# EAGLE design line-following-car (EAGLE 7.4.0)
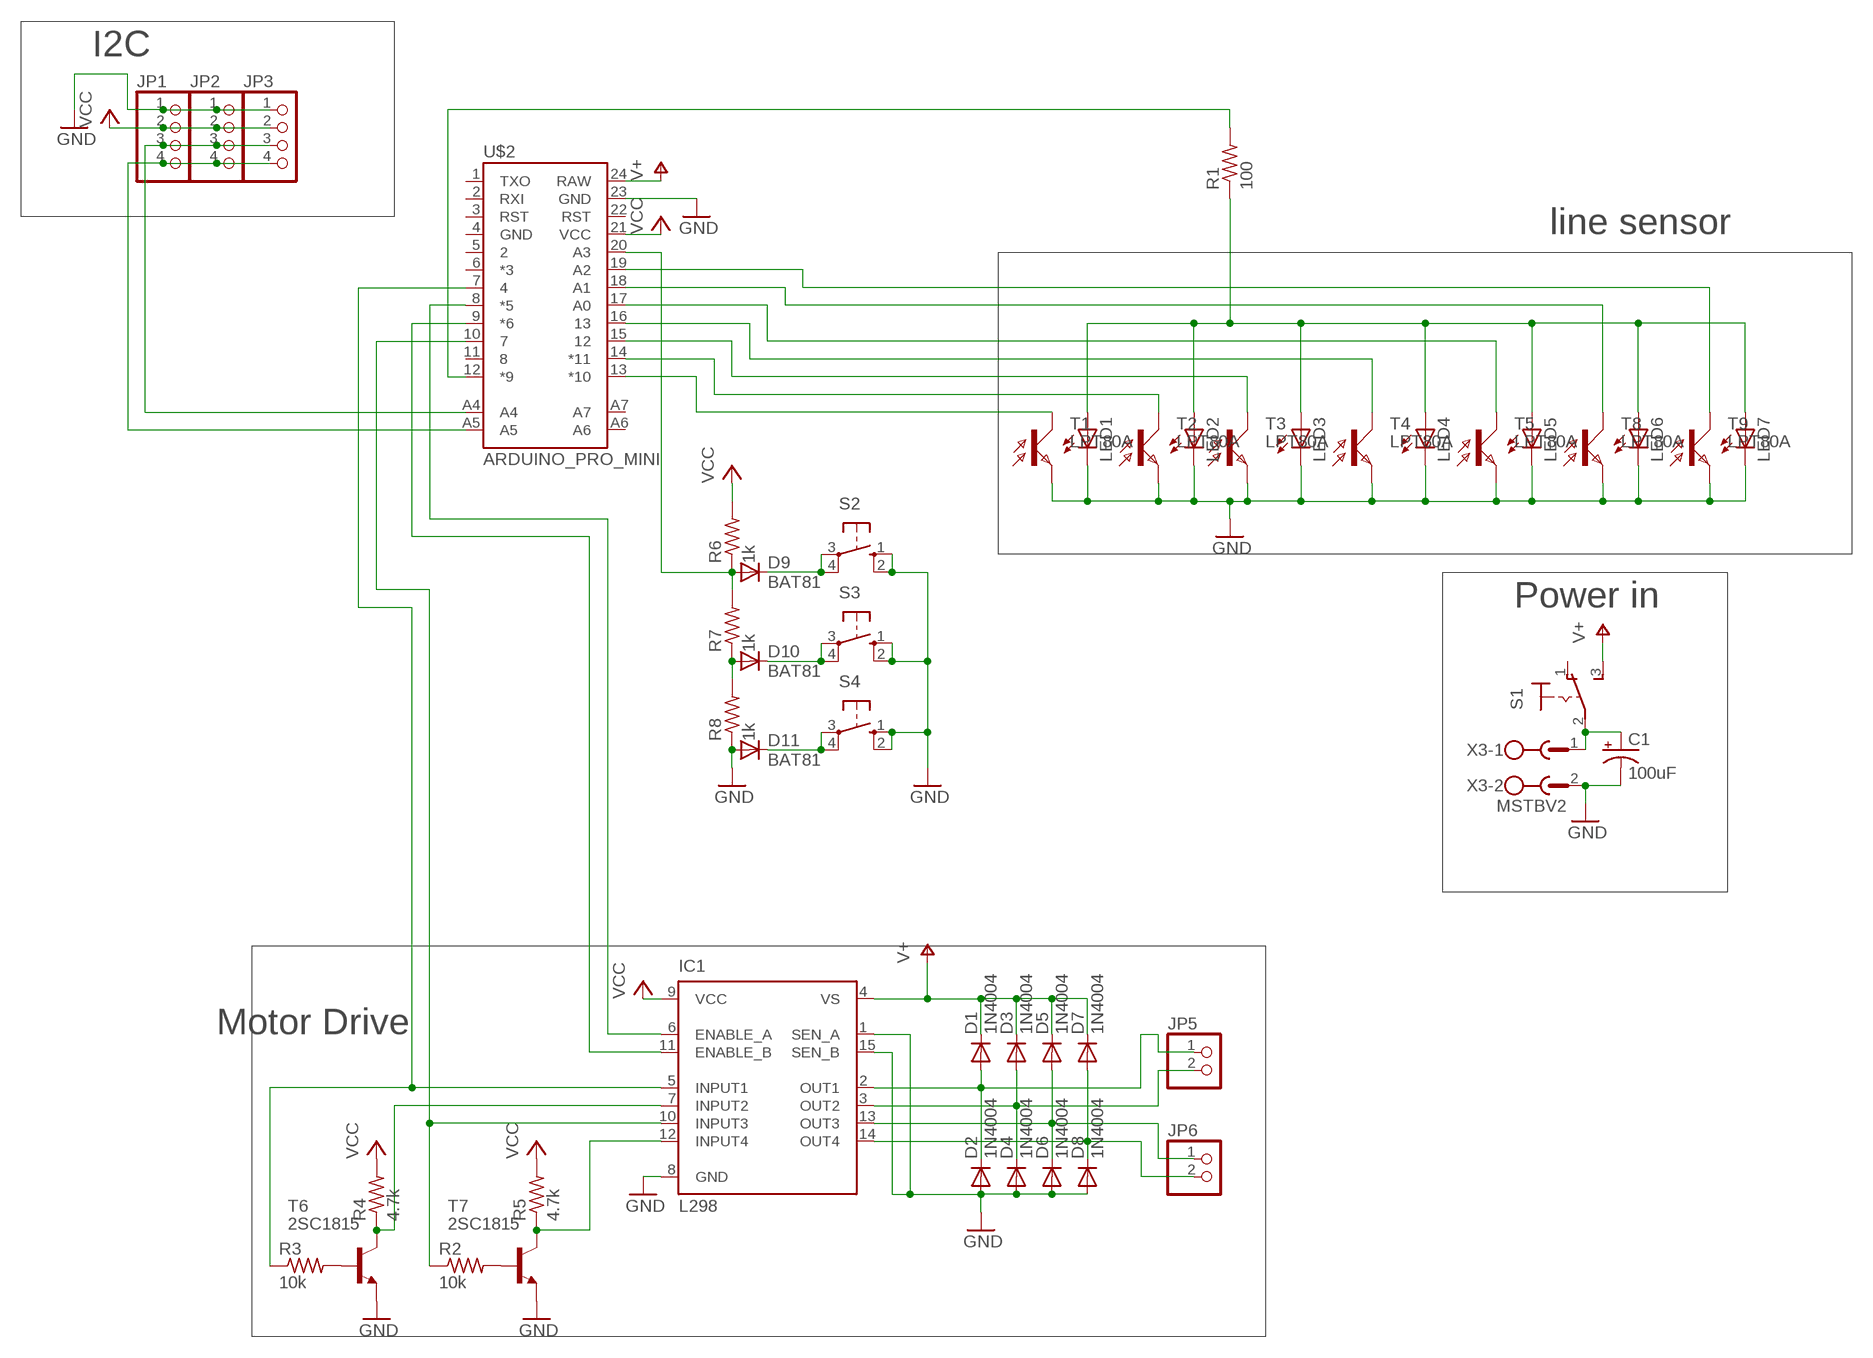
[diagram p0: schematic, sheet 1]

## Parts
C1  100uF  CPOL-USE2-4  [E2-4]
D1  1N4004  [DO41-10]
D2  1N4004  [DO41-10]
D3  1N4004  [DO41-10]
D4  1N4004  [DO41-10]
D5  1N4004  [DO41-10]
D6  1N4004  [DO41-10]
D7  1N4004  [DO41-10]
D8  1N4004  [DO41-10]
D9  BAT81  [DO34-7]
D10  BAT81  [DO34-7]
D11  BAT81  [DO34-7]
IC1  L298  [MULTIWATT-15]
JP1  PINHD-1X4  [1X04]
JP2  PINHD-1X4  [1X04]
JP3  PINHD-1X4  [1X04]
JP5  PINHD-1X2  [1X02]
JP6  PINHD-1X2  [1X02]
LED1  LED3MM  [LED3MM]
LED2  LED3MM  [LED3MM]
LED3  LED3MM  [LED3MM]
LED4  LED3MM  [LED3MM]
LED5  LED3MM  [LED3MM]
LED6  LED3MM  [LED3MM]
LED7  LED3MM  [LED3MM]
R1  100  R-US_0204/5  [0204/5]
R2  10k  R-US_0204/5  [0204/5]
R3  10k  R-US_0204/5  [0204/5]
R4  4.7k  R-US_0204/5  [0204/5]
R5  4.7k  R-US_0204/5  [0204/5]
R6  1k  R-US_0207/7  [0207/7]
R7  1k  R-US_0207/7  [0207/7]
R8  1k  R-US_0207/7  [0207/7]
S1  320-916  [320-916]
S2  10-XX  [B3F-10XX]
S3  10-XX  [B3F-10XX]
S4  10-XX  [B3F-10XX]
T1  LPT80A  [LPT80A]
T2  LPT80A  [LPT80A]
T3  LPT80A  [LPT80A]
T4  LPT80A  [LPT80A]
T5  LPT80A  [LPT80A]
T6  2SC1815  [TO92-ECB]
T7  2SC1815  [TO92-ECB]
T8  LPT80A  [LPT80A]
T9  LPT80A  [LPT80A]
U$2  ARDUINO_PRO_MINI  [ARDUINO_PRO_MINI]
X3  MSTBV2  [MSTBV2]

## Nets
GND: C1.- D2.A D4.A D6.A D8.A D11.A IC1.1(SEN_A) IC1.8(GND) IC1.15(SEN_B) JP1.1 JP2.1 JP3.1 LED1.K(C) LED2.K(C) LED3.K(C) LED4.K(C) LED5.K(C) LED6.K(C) LED7.K(C) R8.1 S2.1(S) S2.2(S1) S3.1(S) S3.2(S1) S4.1(S) S4.2(S1) T1.E T2.E T3.E T4.E T5.E T6.E T7.E T8.E T9.E U$2.23(GND) X3.2
N$1: LED1.A LED2.A LED3.A LED4.A LED5.A LED6.A LED7.A R1.1
N$2: R2.2 T7.B
N$3: R1.2 U$2.12(*9)
N$4: R3.2 T6.B
N$5: T1.C U$2.13(*10)
N$6: T2.C U$2.14(*11)
N$7: T3.C U$2.15
N$8: T4.C U$2.16
N$9: T5.C U$2.17(A0)
N$10: D1.A D2.C IC1.2(OUT1) JP5.1
N$11: IC1.7(INPUT2) R4.1 T6.C
N$12: IC1.12(INPUT4) R5.1 T7.C
N$13: D3.A D4.C IC1.3(OUT2) JP5.2
N$14: IC1.5(INPUT1) R3.1 U$2.7
N$15: IC1.6(ENABLE_A) U$2.8(*5)
N$16: IC1.10(INPUT3) R2.1 U$2.10
N$17: D9.A R6.1 R7.2 U$2.20(A3)
N$18: D5.A D6.C IC1.13(OUT3) JP6.1
N$19: D7.A D8.C IC1.14(OUT4) JP6.2
N$20: D10.A R7.1 R8.2
N$21: D9.C S2.3(P) S2.4(P1)
N$23: JP1.4 JP2.4 JP3.4 U$2.A5
N$24: IC1.11(ENABLE_B) U$2.9(*6)
N$25: D10.C S3.3(P) S3.4(P1)
N$26: C1.+ S1.2(P) X3.1
N$28: D11.C S4.3(P) S4.4(P1)
N$30: JP1.3 JP2.3 JP3.3 U$2.A4
N$32: T8.C U$2.18(A1)
N$33: T9.C U$2.19(A2)
V+: D1.C D3.C D5.C D7.C IC1.4(VS) S1.3(S) U$2.24(RAW)
VCC: IC1.9(VCC) JP1.2 JP2.2 JP3.2 R4.2 R5.2 R6.2 U$2.21(VCC)
Unconnected: S1.1(O) U$2.1(TXO) U$2.2(RXI) U$2.3(RST) U$2.4(GND) U$2.5 U$2.6(*3) U$2.11 U$2.22(RST) U$2.A6 U$2.A7

## Notes on the sheet
- I2C
- line sensor
- Power in
- Motor Drive

## Library data of the parts
C1 = adafruit:CPOL-US: POLARIZED CAPACITOR, American symbol
D1-D8 = diode:1N4004: DIODE general purpose rectifier, 1 A
D9-D11 = diode:BAT81: DIODE barrier diode
IC1 = st-microelectronics:L298: DUAL FULL-BRIDGE DRIVER; MPN: L298N; OC_FARNELL: 1589425; OC_NEWARK: 32M1527
JP1-JP3 = pinhead:PINHD-1X4: PIN HEADER
JP5 JP6 = pinhead:PINHD-1X2: PIN HEADER
LED1-LED7 = led:LED: LED OSRAM: - CHIPLED LG R971, LG N971, LY N971, LG Q971, LY Q971, LO R971, LY R971 LH N974, LH R974 LS Q976, LO Q976, LY Q976 LO Q996 - Hyper CHIPLED LW Q18S LB Q993, LB Q99A, LB R99A - SideLED LS A670, LO A670, LY A670, LG A670, LP A670 LB A673, LV A673, LT A673, LW A673 LH A674 LY A675 LS A676, LA A676, LO A676, LY A676, LW A676 LS A679, LY A679, LG A679 - Hyper Micro SIDELED® LS Y876, LA Y876, LO Y876, LY Y876 LT Y87S - SmartLED LW L88C, LW L88S LB L89C, LB L89S, LG L890 LS L89K, LO L89K, LY L89K LS L896, LA L896, LO L896, LY L896 - TOPLED LS T670, LO T670, LY T670, LG T670, LP T670 LSG T670, LSP T670, LSY T670, LOP T670, LYG T670 LG T671, LOG T671, LSG T671 LB T673, LV T673, LT T673, LW T673 LH T674 LS T676, LA T676, LO T676, LY T676, LB T676, LH T676, LSB T676, LW T676 LB T67C, LV T67C, LT T67C, LS T67K, LO T67K, LY T67K, LW E67C LS E67B, LA E67B, LO E67B, LY E67B, LB E67C, LV E67C, LT E67C LW T67C LS T679, LY T679, LG T679 LS T770, LO T770, LY T770, LG T770, LP T770 LB T773, LV T773, LT T773, LW T773 LH T774 LS E675, LA E675, LY E675, LS T675 LS T776, LA T776, LO T776, LY T776, LB T776 LHGB T686 LT T68C, LB T68C - Hyper Mini TOPLED® LB M676 - Mini TOPLED Santana® LG M470 LS M47K, LO M47K, LY M47K Source: http://www.osram.convergy.de LUXEON: - LUMILED® LXK2-PW12-R00, LXK2-PW12-S00, LXK2-PW14-U00, LXK2-PW14-V00 LXK2-PM12-R00, LXK2-PM12-S00, LXK2-PM14-U00 LXK2-PE12-Q00, LXK2-PE12-R00, LXK2-PE12-S00, LXK2-PE14-T00, LXK2-PE14-U00 LXK2-PB12-K00, LXK2-PB12-L00, LXK2-PB12-M00, LXK2-PB14-N00, LXK2-PB14-P00, LXK2-PB14-Q00 LXK2-PR12-L00, LXK2-PR12-M00, LXK2-PR14-Q00, LXK2-PR14-R00 LXK2-PD12-Q00, LXK2-PD12-R00, LXK2-PD12-S00 LXK2-PH12-R00, LXK2-PH12-S00 LXK2-PL12-P00, LXK2-PL12-Q00, LXK2-PL12-R00 Source: www.luxeon.com KINGBRIGHT: KA-3528ASYC Source: www.kingbright.com
R1-R8 = adafruit:R-US_: RESISTOR, American symbol
S1 = switch:320-916: TOGGLE SWITCH distributor RS Components
S2-S4 = switch-omron:10-XX: OMRON SWITCH; MPN: B3F-1000; OC_FARNELL: 176432; OC_NEWARK: 36M3542
T1-T5 T8 T9 = opto-trans-siemens:LPT80A: PHOTO TRANSISTOR; OC_FARNELL: unknown; OC_NEWARK: unknown
T6 T7 = transistor:2SC1815: NPN EPITAXIAL TRANSISTOR Source: TOSHIBA .. 2SC1815 1.pdf
U$2 = SparkFun-Boards_0:ARDUINO_PRO_MINI
X3 = con-phoenix-508:MSTBV2: PHOENIX; MPN: MSTBV 2,5/2-GF-5.08; OC_FARNELL: 1792792; OC_NEWARK: 69R9845

## Board
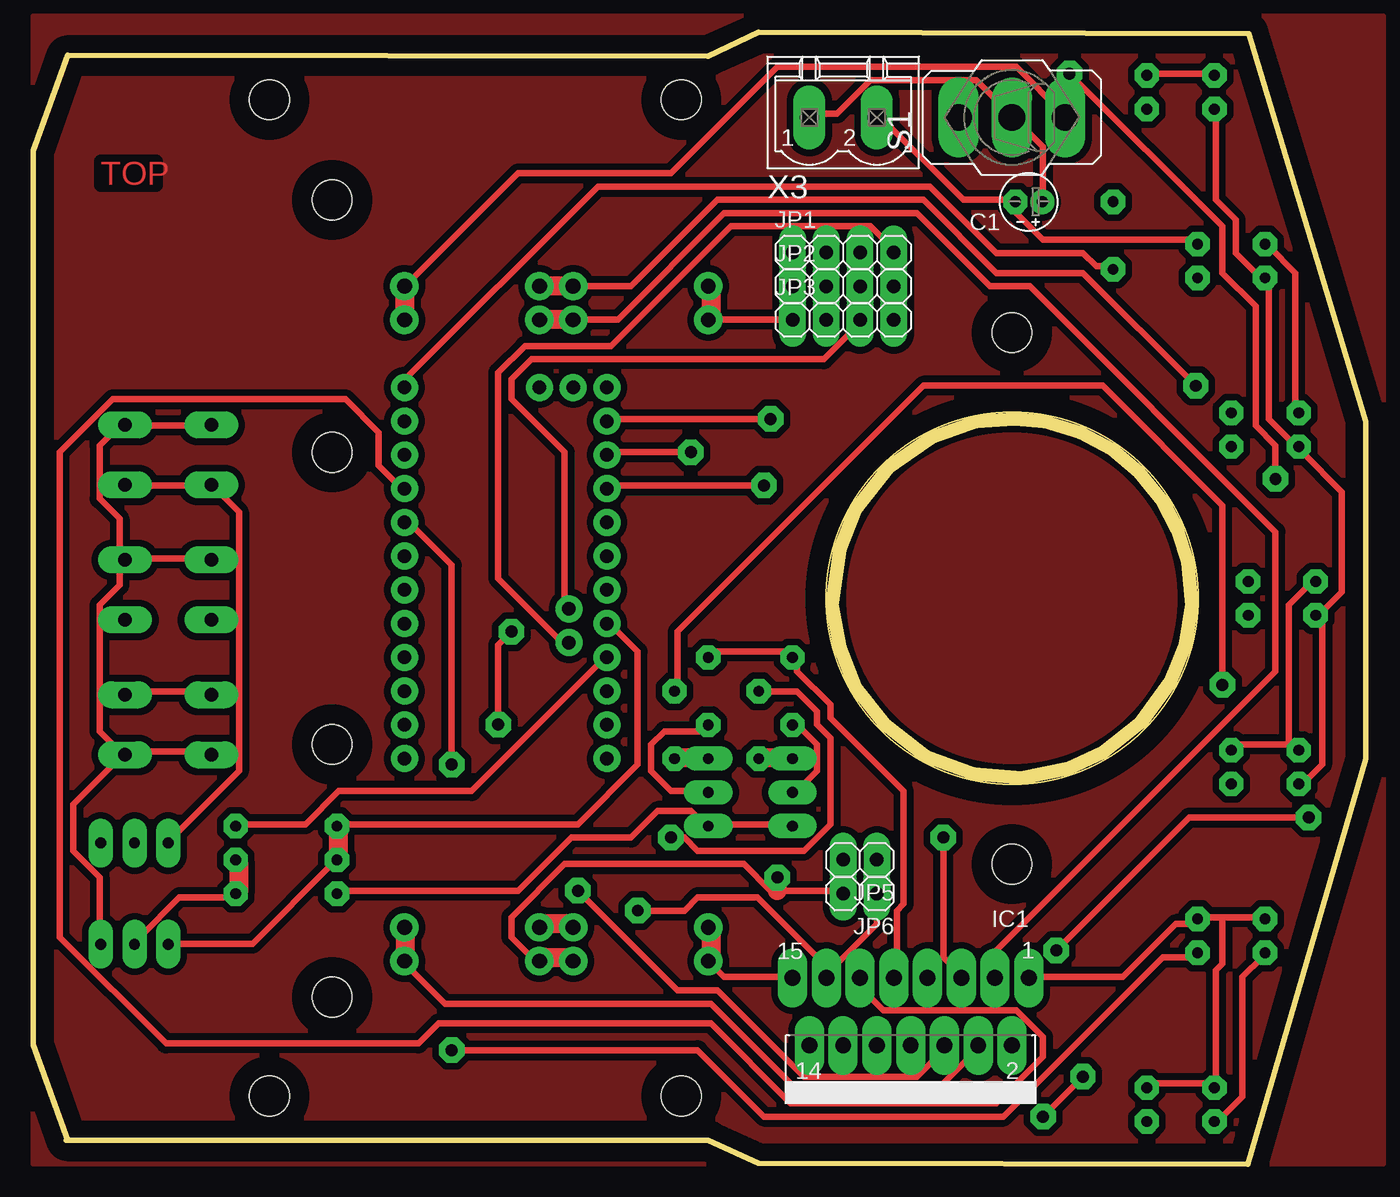
[diagram p1: board, top side]
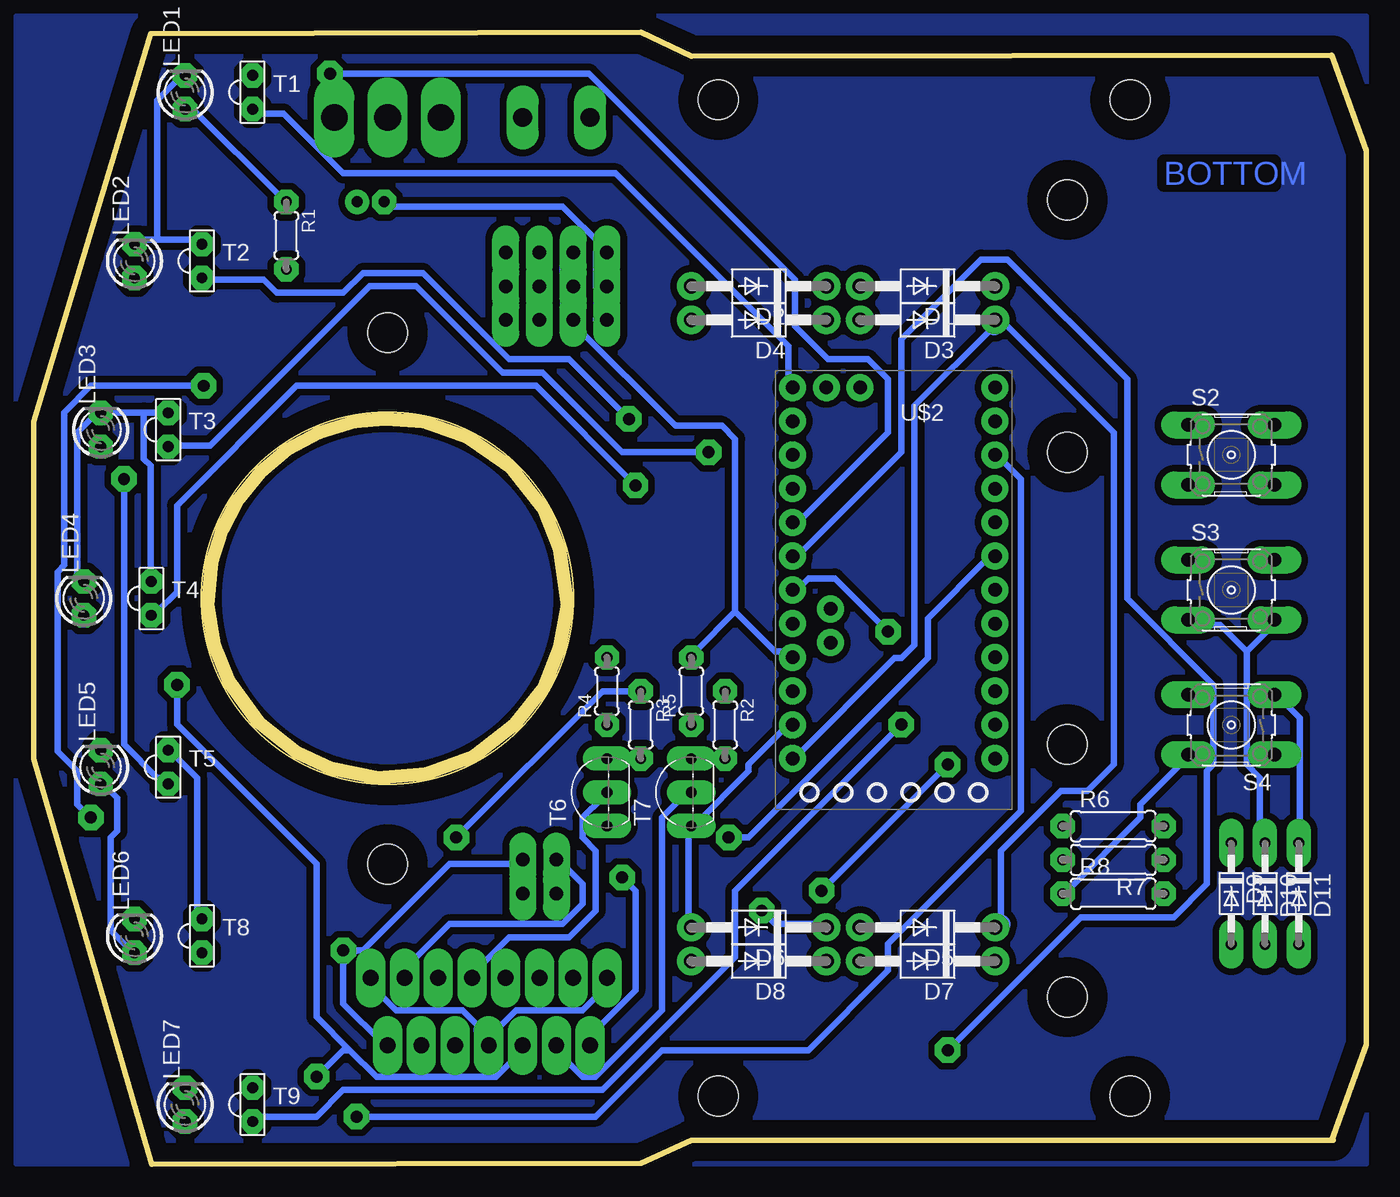
[diagram p2: board, bottom side, seen from below]

Size 100.33 x 85.08 mm. Coordinates in mm from the lower left corner, seen from the top.
Outline: 0,8.89 2.54,1.72 50.8,1.72 50.8,1.73 54.61,0 91.44,0 96.52,17.78 100.33,30.48 100.33,55.88 96.52,68.58 91.44,85.08 54.6,85.08 50.8,83.37 2.54,83.37 0,76.2 0,8.89
Outline: circle at 73.66,42.54 radius 14
Copper layers (1*16): Top 0.035mm / dielectric 1.5mm / Bottom 0.035mm
Design rules "default *": minimum track width 0.5mm, minimum drill 0.9mm, track to track 0.5mm, track to pad 0.5mm, pad to pad 0.5mm, via to via 0.5mm, smd to smd 0.5mm, copper to edge 1.5mm, drill to drill 0.5mm, minimum pad ring 10mil, minimum via ring 8mil, stop-mask expansion 4mil, vias tented up to drill 0mil, thermal gap 0mil
Holes 3 mm at 22.5,12.54 22.5,72.54 22.5,53.54 22.5,31.54 73.66,62.54 73.66,22.54 17.78,5.08 17.78,80.08 48.78,5.08 48.78,80.08
Milling: 40 lines

### Footprints (pad centres in the part's own frame; a part is rotated, then mirrored left to right if it is on the bottom)
E2-4 = drill 0.813 pad 1.422: + -1.016,0 | drill 0.813 pad 1.422 octagon: - 1.016,0
DO41-10 = drill 1.118: A 5.08,0; C -5.08,0
DO34-7 = drill 0.813 long: A 3.81,0; C -3.81,0
MULTIWATT-15 = drill 1.2 long: 1 -8.89,-7.62; 2 -7.62,-2.54; 3 -6.35,-7.62; 4 -5.08,-2.54; 5 -3.81,-7.62; 6 -2.54,-2.54; 7 -1.27,-7.62; 8 0,-2.54; 9 1.27,-7.62; 10 2.54,-2.54; 11 3.81,-7.62; 12 5.08,-2.54; 13 6.35,-7.62; 14 7.62,-2.54; 15 8.89,-7.62
1X04 = drill 1.016 long: 1 -3.81,0; 2 -1.27,0; 3 1.27,0; 4 3.81,0
1X02 = drill 1.016 long: 1 -1.27,0; 2 1.27,0
LED3MM = drill 0.813 octagon: A -1.27,0; K 1.27,0
0204/5 = drill 0.813 pad 1.676 octagon: 1 -2.54,0; 2 2.54,0
0207/7 = drill 0.813 octagon: 1 -3.81,0; 2 3.81,0
320-916 = drill 2.007 long: 1 0,4.013; 2 0,0; 3 0,-4.013
B3F-10XX = drill 1.016 long: 1 -3.251,2.261; 2 3.251,2.261; 3 -3.251,-2.261; 4 3.251,-2.261
LPT80A = drill 0.813 octagon: C 0,-1.27; E 0,1.27
TO92-ECB = drill 0.813 long: B 2.54,0; C 0,0; E -2.54,0
ARDUINO_PRO_MINI = drill 1.016 pad 1.88: 1 -7.62,12.7; 2 -7.62,10.16; 3 -7.62,7.62; 4 -7.62,5.08; 5 -7.62,2.54; 6 -7.62,0; 7 -7.62,-2.54; 8 -7.62,-5.08; 9 -7.62,-7.62; 10 -7.62,-10.16; 11 -7.62,-12.7; 12 -7.62,-15.24; 13 7.62,-15.24; 14 7.62,-12.7; 15 7.62,-10.16; 16 7.62,-7.62; 17 7.62,-5.08; 18 7.62,-2.54; 19 7.62,0; 20 7.62,2.54; 21 7.62,5.08; 22 7.62,7.62; 23 7.62,10.16; 24 7.62,12.7; A4 4.763,1.429; A5 4.763,3.969; A6 2.54,-15.24; A7 5.08,-15.24
MSTBV2 = drill 1.397 long: 1 -2.54,0; 2 2.54,0

### Placement (x,y rotation side)
C1  74.93,72.39 180 top
D1  33.02,66.04 180 bottom
D2  45.72,66.04 180 bottom
D3  33.02,63.5 180 bottom
D4  45.72,63.5 180 bottom
D5  33.02,17.78 180 bottom
D6  45.72,17.78 180 bottom
D7  33.02,15.24 180 bottom
D8  45.72,15.24 180 bottom
D9  10.16,20.32 270 bottom
D10  7.62,20.32 270 bottom
D11  5.08,20.32 270 bottom
IC1  66.04,6.35 180 top
JP1  60.96,68.58 0 top
JP2  60.96,66.04 0 top
JP3  60.96,63.5 0 top
JP5  62.23,22.86 180 top
JP6  62.23,20.32 180 top
LED1  88.9,80.64 90 bottom
LED2  92.71,67.94 90 bottom
LED3  95.25,55.24 90 bottom
LED4  96.52,42.54 90 bottom
LED5  95.25,29.84 90 bottom
LED6  92.71,17.14 90 bottom
LED7  88.9,4.44 90 bottom
R1  81.28,69.85 270 bottom
R2  48.26,33.02 270 bottom
R3  54.61,33.02 270 bottom
R4  57.15,35.56 90 bottom
R5  50.8,35.56 90 bottom
R6  19.05,25.4 0 bottom
R7  19.05,22.86 180 bottom
R8  19.05,20.32 0 bottom
S1  73.66,78.74 90 top
S2  10.16,53.34 0 bottom
S3  10.16,43.18 0 bottom
S4  10.16,33.02 180 bottom
T1  83.82,80.64 0 bottom
T2  87.63,67.94 0 bottom
T3  90.17,55.24 0 bottom
T4  91.44,42.54 0 bottom
T5  90.17,29.84 0 bottom
T6  57.15,27.94 90 bottom
T7  50.8,27.94 90 bottom
T8  87.63,17.14 0 bottom
T9  83.82,4.44 0 bottom
U$2  35.56,43.18 180 bottom
X3  60.96,78.74 0 top

### Tracks (layer width: path | path; a pad name or v marks a point on that pad's centre or on a via)
GND
  Top 0.5: S3.2 7,45.54 13,45.54 S3.1 | S2.1 13,55.54 7,55.54 S2.2 6.5,55.54 5,54.04 5,50.04 6.5,48.54 6.5,45.54 S3.2 | D11.A 5,16.54 5,21.54 3,23.54 3,27.04 6.5,30.54 S4.1 | S4.1 7,31.04 13,31.04 S4.2 | S3.2 6.5,45.04 6.5,43.54 5,42.04 5,32.54 6.5,31.04 S4.1 | 51,15.54 D8.A 52,14.04 57,14.04 IC1.15 | 51,17.54 D6.A | T6.E 57,25.54 51,25.54 T7.E 50.5,25.54 49.5,26.54 47,26.54 45,24.54 40.5,24.54 36.5,20.54 23,20.54 R8.1 | 51,66.04 D2.A | D4.A 51,63.54 57,63.54 JP3.1 | X3.2 63.5,79.04 70,72.54 73.5,72.54 C1.- 74,72.04 74,71.54 76,69.54 87.5,69.54 T2.E | T1.E 84,82.04 88.5,82.04 LED1.K | T9.E 84,6.04 88.5,6.04 LED7.K 89,6.04 89,14.54 89.5,15.04 89.5,18.54 | 89.5,18.54 92.5,18.54 LED6.K | 89.5,18.54 88,18.54 T8.E 87.5,18.04 86,18.04 82,14.04 75,14.04 IC1.1 | 94.5,31.54 95,31.54 LED5.K 94.5,31.54 | 94.5,31.54 90.5,31.54 T5.E | 94.5,31.54 94.5,42.04 96.5,44.04 LED4.K | LED2.K 93,69.04 95,67.04 95,56.54 LED3.K
  Top 1.422: 51,17.54 51,15.54 | 51,66.04 51,63.54
  Bottom 0.5: R8.1 22.5,20.54 17,26.04 17,27.04 13.5,30.54 S4.2 | 66.5,10.04 66.5,9.04 IC1.8 | 66.5,10.04 68,11.54 73,11.54 75,13.54 IC1.1 | U$2.23 43.5,32.54 44,32.54 46.5,30.04 46.5,29.54 50.5,25.54 T7.E 51,25.04 51,18.04 D6.A | 66.5,10.04 65.5,10.04 64,11.54 59,11.54 57,13.54 IC1.15 | 57.5,63.54 JP3.1 | 57.5,68.54 JP1.1 57.5,69.04 60.5,72.04 73.5,72.04 C1.- | 57.5,66.04 JP2.1 | 91,69.54 92.5,69.54 LED2.K | 91,69.54 88,69.54 T2.E | 91,69.54 91,80.04 89.5,81.54 89,81.54 LED1.K | 92,56.54 95,56.54 LED3.K 95.5,56.54 97,55.04 97,44.04 LED4.K | 92,56.54 90.5,56.54 T3.E | 92,56.54 92,53.04 91.5,52.54 91.5,44.04 T4.E | T8.E 88,18.54 88,29.04 90,31.04 T5.E
  Bottom 1.422: 66.5,10.04 IC1.8 | 57.5,63.54 57.5,66.04 57.5,68.54
N$1
  Top 0.5: LED7.A 89,3.54 89.5,3.54 91,5.04 91,14.04 92.5,15.54 LED6.A | LED5.A 95.5,29.04 96,29.04 97,30.04 97,41.04 LED4.A 97,41.54 98.5,43.04 98.5,50.54 95.5,53.54 LED3.A 95,54.04 93,56.04 93,66.54 LED2.A 92.5,66.54 90.5,68.54 90.5,71.04 89,72.54 89,79.04 LED1.A
  Bottom 0.5: R1.1 81.5,72.54 88.5,79.54 LED1.A | LED6.A 93,16.04 94.5,17.54 94.5,24.54 94,25.04 94,27.54 95,28.54 LED5.A
N$2
  Top 0.5: 48.5,30.54 R2.2 | 50.5,30.54 T7.B
  Top 1.422: 50.5,30.54 48.5,30.54
N$3
  Top 0.5: R1.2 81,67.54 80,67.54 79,68.54 72.5,68.54 67.5,73.54 42.5,73.54 27.5,58.54 U$2.12
N$4
  Top 0.5: 55,30.54 R3.2 | 57,30.54 T6.B
  Top 1.422: 57,30.54 55,30.54
N$5
  Bottom 0.5: T1.C 83.5,79.04 81.5,79.04 77,74.54 56.5,74.54 43.5,61.54 43.5,58.54 U$2.13
N$6  (via drill 0.9)
  Top 0.5: v55.5,56.04 43.5,56.04 U$2.14
  Bottom 0.5: v55.5,56.04 60,60.54 64.5,60.54 71,67.04 75.5,67.04 77,65.54 82,65.54 83,66.54 87.5,66.54 T2.C
N$7  (via drill 0.9)
  Top 0.5: v49.5,53.54 43.5,53.54 U$2.15
  Bottom 0.5: v49.5,53.54 56,53.54 62,59.54 65,59.54 71.5,66.04 75,66.04 87,54.04 90,54.04 T3.C
N$8  (via drill 0.9)
  Top 0.5: v55,51.04 43.5,51.04 U$2.16
  Bottom 0.5: v55,51.04 62.5,58.54 80.5,58.54 89.5,49.54 89.5,43.04 91,41.54 T4.C
N$9  (via drill 0.9)
  Top 0.5: v93.5,51.54 93.5,54.04 92,55.54 92,64.54 89.5,67.04 89.5,70.54 v78,82.04
  Bottom 0.5: v93.5,51.54 93.5,31.54 91,29.04 90.5,29.04 T5.C | v78,82.04 58.5,82.04 43,66.54 43,63.04 40.5,60.54 37.5,60.54 36,59.04 36,55.04 43,48.04 U$2.17
N$10  (via drill 0.9)
  Top 0.5: D2.C 45,66.04 51.5,72.54 67,72.54 72.5,67.04 79,67.04 v87.5,58.54 | v96,26.04 87,26.04 v77,16.04
  Top 1.422: D2.C D1.A
  Bottom 0.5: 76.5,15.54 77,15.04 77,12.04 74,9.04 IC1.2 | 76.5,15.54 76,16.04 75.5,16.04 69,22.54 63.5,22.54 JP5.1 | v87.5,58.54 96,58.54 98,56.54 98,45.04 98.5,44.54 98.5,31.04 97,29.54 97,27.04 v96,26.04 | 76.5,15.54 v77,16.04
N$11
  Top 0.5: T6.C 57.5,28.04 59,29.54 59,31.54 57.5,33.04 R4.1
  Bottom 0.5: IC1.7 67,14.04 67,14.54 64.5,17.04 60,17.04 58,19.04 58,23.54 59,24.54 59,26.04 57.5,27.54 T6.C
N$12
  Top 0.5: T7.C 50.5,28.04 48,28.04 46.5,29.54 46.5,31.54 47.5,32.54 50.5,32.54 R5.1
  Bottom 0.5: IC1.12 60.5,8.54 60.5,8.04 59,6.54 58,6.54 53,11.54 53,26.04 51,28.04 T7.C
N$13
  Top 0.5: 38.5,63.54 D3.A | 40.5,63.54 D4.C 41,63.54 44,63.54 52,71.54 66.5,71.54 72,66.04 75,66.04 93.5,47.54 93.5,37.04 72.5,16.04 72.5,14.04 IC1.3
  Top 1.422: 40.5,63.54 38.5,63.54
  Bottom 0.5: JP5.2 60.5,22.54 59,21.04 59,19.54 60.5,18.04 69,18.04 72,15.04 72,14.04 IC1.3
N$14  (via drill 0.9)
  Top 0.5: v68.5,24.54 68.5,15.54 70,14.04 IC1.5 | v48,24.54 49,24.54 50,23.54 58,23.54 60,25.54 60,32.04 59,33.04 59,34.04 57.5,35.54 55,35.54 R3.1
  Bottom 0.5: v68.5,24.54 57.5,35.54 55,35.54 R3.1 | v48,24.54 46.5,24.54 33,38.04 33,41.04 28.5,45.54 28,45.54 U$2.7
N$15  (via drill 0.9)
  Top 0.5: v31.5,30.04 31.5,45.04 28.5,48.04 28,48.04 U$2.8 | v41,20.54 48.5,13.04 51.5,13.04 58,6.54 66.5,6.54 68.5,8.54 IC1.6
  Bottom 0.5: v41,20.54 v31.5,30.04
N$16  (via drill 0.9)
  Top 0.5: v89.5,36.04 89.5,49.54 80.5,58.54 67,58.54 48.5,40.04 48.5,36.04 R2.1 | v79,6.54 v76,3.54
  Bottom 0.5: v89.5,36.04 89.5,33.04 79,22.54 79,11.04 76.5,8.54 | 76.5,8.54 74.5,6.54 65.5,6.54 63.5,8.54 IC1.10 | v76,3.54 58,3.54 53,8.54 42,8.54 36,14.54 36,16.54 26,26.54 26,51.54 27.5,53.04 U$2.10 | v79,6.54 77,8.54 76.5,8.54
N$17
  Top 0.5: D9.A 10.5,16.54 16.5,16.54 22.5,22.54 R7.2 23,23.04 | 23,25.04 R6.1 23,25.54 41,25.54 45.5,30.04 45.5,38.54 43.5,40.54 U$2.20
  Top 1.422: 23,23.04 23,25.04
N$18  (via drill 0.9)
  Top 0.5: 38.5,18.04 D5.A | 40.5,18.04 D6.C | JP6.1 63.5,18.04 60,14.54 | 59.5,14.04 IC1.13 60,14.54 | v45.5,19.04 49,19.04 50,20.04 54.5,20.04 60,14.54
  Top 1.422: 40.5,18.04 38.5,18.04 | 59.5,14.04 60,14.54
  Bottom 0.5: v45.5,19.04 44.5,18.04 41,18.04 D6.C
N$19  (via drill 0.9)
  Top 0.5: JP6.2 60.5,20.54 56,20.54 55.5,20.54 53.5,22.54 40,22.54 36,18.54 36,17.04 38,15.04 D7.A 38.5,15.54 | 40.5,15.54 D8.C
  Top 1.422: 38.5,15.54 40.5,15.54 | 56,20.54 v56,21.54
  Bottom 0.5: v56,21.54 55,20.54 55,13.04 58,10.04 58,9.04 IC1.14
N$20
  Top 0.5: D10.A 8,16.54 8,17.04 11,20.04 15,20.04 R8.2 15.5,20.54 | 15.5,22.54 R7.1
  Top 1.422: 15.5,20.54 15.5,22.54
N$21
  Top 0.5: D9.C 10.5,24.54 15.5,29.54 15.5,49.04 13.5,51.04 S2.3 13,51.04 7,51.04 S2.4
N$22
  pour Bottom: 0,0 0,86.36 101.6,86.36 101.6,0
N$23
  Top 0.5: U$2.A5 40,39.54 39.5,39.54 35,44.04 35,59.54 37,61.54 43.5,61.54 52.5,70.54 63,70.54 64.5,69.04 JP1.4
  Bottom 0.5: 65,63.54 JP3.4 | 65,66.04 JP2.4 | 65,68.54 JP1.4
  Bottom 1.422: 65,63.54 65,66.04 65,68.54
N$24
  Top 0.5: U$2.9 27.5,51.04 26,52.54 26,55.04 23.5,57.54 6,57.54 2,53.54 2,17.04 10,9.04 29,9.04 30.5,10.54 51,10.54 57,4.54 72.5,4.54 76,8.04 76,9.54 74,11.54 64,11.54 62,13.54 IC1.11
N$25
  Bottom 0.5: 9,38.54 9,30.04 8,29.04 8,24.54 D10.C | 9,38.54 7,40.54 S3.4 | 9,38.54 11,40.54 13,40.54 S3.3
N$26
  Top 0.5: C1.+ 76,72.54 76,76.54 74,78.54 S1.2 73.5,79.04 71,81.54 63,81.54 60.5,79.04 58.5,79.04 X3.1
N$27
  pour Top: 0,0 0,86.36 101.6,86.36 101.6,0
N$28
  Top 0.5: S4.4 13,35.54 7,35.54 S4.3
  Bottom 0.5: D11.C 5,24.54 5,33.54 6.5,35.04 S4.3
N$30
  Top 0.5: U$2.A4 40,42.04 40,53.54 36,57.54 36,59.04 37.5,60.54 59.5,60.54 62,63.04 JP3.3
  Bottom 0.5: 62.5,68.54 JP1.3 | 62.5,66.04 JP2.3 | 62.5,63.54 JP3.3
  Bottom 1.422: 62.5,68.54 62.5,66.04 62.5,63.54
N$32  (via drill 0.9)
  Top 0.5: v31.5,8.54 50,8.54 55,3.54 73,3.54 85,15.54 87.5,15.54 T8.C
  Bottom 0.5: v31.5,8.54 21.5,18.54 14.5,18.54 12,21.04 12,29.54 11.5,30.04 11.5,36.04 18,42.54 18,59.04 27,68.04 29,68.04 35,62.04 35,53.54 43,45.54 U$2.18
N$33  (via drill 0.9)
  Top 0.5: v35,33.04 35,39.04 v36,40.04
  Bottom 0.5: v35,33.04 47.5,20.54 47.5,15.54 57.5,5.54 77,5.54 79,3.54 83.5,3.54 T9.C | v36,40.04 40,44.04 42,44.04 43,43.04 U$2.19
V+
  Top 0.5: 28,15.54 D7.C 28,15.04 31,12.04 51,12.04 57.5,5.54 68,5.54 71,8.54 IC1.4 | 28,17.54 D5.C | 28,63.54 D3.C | S1.3 77.5,79.04 74,82.54 56,82.54 48,74.54 36.5,74.54 28,66.04 D1.C
  Top 1.422: 28,17.54 28,15.54 | 28,63.54 28,66.04
  Bottom 0.5: 28,63.04 34,57.04 34,39.04 35,38.04 35.5,38.04 43,30.54 U$2.24 | 27.5,18.04 27.5,23.54 23,28.04 21,28.04 19,30.04 19,55.04 27.5,63.54 D3.C
  Bottom 1.422: 28,63.04 D3.C | 27.5,18.04 D5.C
VCC
  Top 0.5: R6.2 15.5,25.54 20.5,25.54 23,28.04 33,28.04 43,38.04 U$2.21 | R5.2 51,38.54 57,38.54 R4.2 57.5,38.04 57.5,37.04 60,34.54 60,33.54 65.5,28.04 65.5,19.54 65,19.04 65,14.04 IC1.9
  Bottom 0.5: 60,63.54 JP3.2 59.5,63.04 52,55.54 48.5,55.54 47.5,54.54 47.5,41.54 | 60,68.54 JP1.2 | 60,66.04 JP2.2 | 47.5,41.54 50.5,38.54 R5.2 | 47.5,41.54 44.5,38.54 43.5,38.54 U$2.21
  Bottom 1.422: 60,63.54 60,66.04 60,68.54

### Text on the board
Top: TOP
Bottom: BOTTOM